# Altium project bt4.PrjPcb
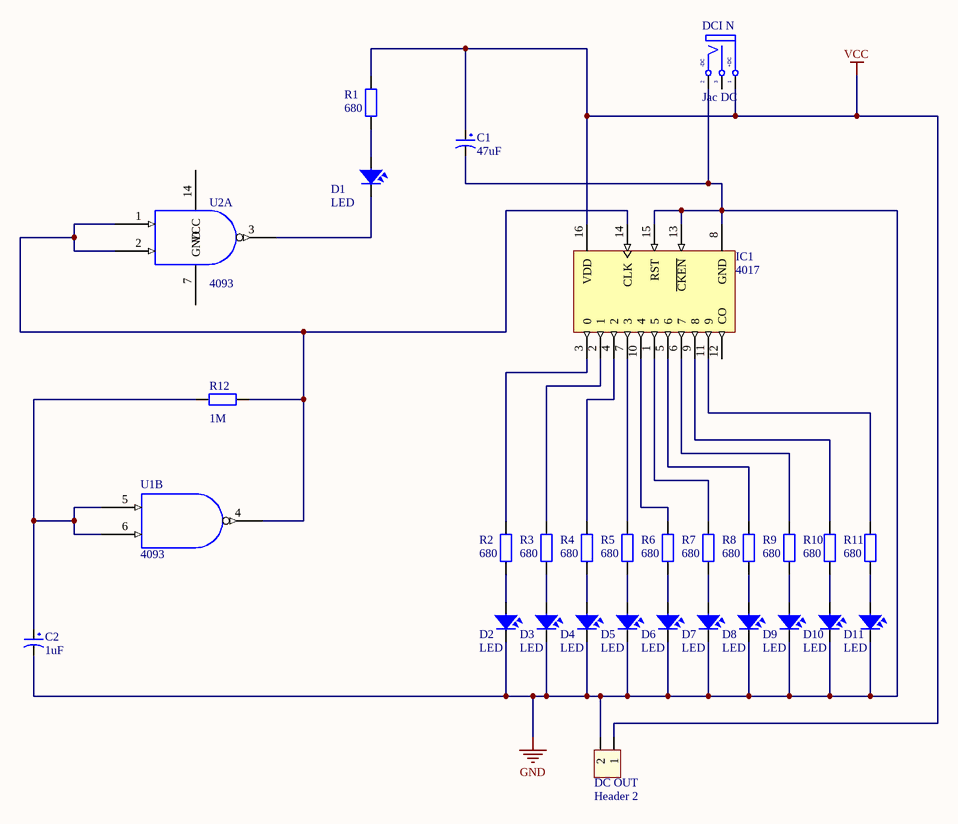
[diagram p0: schematic.SchDoc]
1 sheet, 30 parts. Net scope: global (net labels, ports and power ports of the same name join across sheets).
Board file: PCB.PcbDoc

## Sheet schematic.SchDoc
size A; SheetNumber: 1; SheetTotal: 1

### Parts
C1  47uF  [CP1/2.5]
C2  1uF  [CP1/2.5]
D1  LED  [LED-3]
D2  LED  [LED-3]
D3  LED  [LED-3]
D4  LED  [LED-3]
D5  LED  [LED-3]
D6  LED  [LED-3]
D7  LED  [LED-3]
D8  LED  [LED-3]
D9  LED  [LED-3]
D10  LED  [LED-3]
D11  LED  [LED-3]
DC_OUT  Header 2  [HED2]
DCI_N  Jac DC  [DC-IN]
IC1  4017  [DIP16/W0.3]
R1  680  [DIEN TRO 1/4 W]
R2  680  [DIEN TRO 1/4 W]
R3  680  [DIEN TRO 1/4 W]
R4  680  [DIEN TRO 1/4 W]
R5  680  [DIEN TRO 1/4 W]
R6  680  [DIEN TRO 1/4 W]
R7  680  [DIEN TRO 1/4 W]
R8  680  [DIEN TRO 1/4 W]
R9  680  [DIEN TRO 1/4 W]
R10  680  [DIEN TRO 1/4 W]
R11  680  [DIEN TRO 1/4 W]
R12  1M  [DIEN TRO 1/4 W]
U1  4093  [DIP14]  (part B of 4)
U2  4093  [DIP14]  (part A of 4)

### Nets
GND: C1.2 C2.2 D2.2 D3.2 D4.2 D5.2 D6.2 D7.2 D8.2 D9.2 D10.2 D11.2 DC_OUT.2 DCI_N.2(TN) IC1.8(GND) IC1.13(~{CKEN}) IC1.15(RST)
VCC: C1.1 DC_OUT.1 DCI_N.1(T) IC1.16(VDD) R1.2
NetC2_1: C2.1 R12.2 U1.5 U1.6
NetD1_1: D1.1 R1.1
NetD1_2: D1.2 U2.3
NetD2_1: D2.1 R2.1
NetD3_1: D3.1 R3.1
NetD4_1: D4.1 R4.1
NetD5_1: D5.1 R5.1
NetD6_1: D6.1 R6.1
NetD7_1: D7.1 R7.1
NetD8_1: D8.1 R8.1
NetD9_1: D9.1 R9.1
NetD10_1: D10.1 R10.1
NetD11_1: D11.1 R11.1
NetIC1_1: IC1.1(5) R7.2
NetIC1_2: IC1.2(1) R3.2
NetIC1_3: IC1.3(0) R2.2
NetIC1_4: IC1.4(2) R4.2
NetIC1_5: IC1.5(6) R8.2
NetIC1_6: IC1.6(7) R9.2
NetIC1_7: IC1.7(3) R5.2
NetIC1_9: IC1.9(8) R10.2
NetIC1_10: IC1.10(4) R6.2
NetIC1_11: IC1.11(9) R11.2
NetIC1_14: IC1.14(CLK) R12.1 U1.4 U2.1 U2.2

Not connected (* = marked no-connect by the designer): DCI_N 3(S); IC1 12(CO); U2 7(GND) 14(VCC)

### Notes on the sheet
- (in symbol DCIN) -DC; +DC

### Library data of the parts
C1 C2 = CP2: C 47uF/50V , 220uF/16V; Value: 47uF/16 - 50V; Description 1: 470uF/6,3V - 330uF/10V - 220uF/16V; Description 2: 100uF/25V - 35V - 47uF/50V - 22uF/100V; Description 3: 33uF => 47uF/63V - 1uF => 4,7uF/160V; Description 4: 1uF => 2,2uF/250V - 1uF/350V
D1-D11 = LED: LED Single colour Green and Red; Value: LED 3 ly Single Colour
DC_OUT = Hed2: Header 2 (Green); Value: Header 2
DCI_N = DCIN: Jac DC input; Value: Jac DC
IC1 = 4017: Decade Counter/Divider with 10 Decoded Outputs; Designed by: VanDungEvn; Value: CD4017
R1-R12 = Res 1/4 W: Resistor; Value: R; Published: 8-Jun-2000; LatestRevisionDate: 17-Jul-2002; LatestRevisionNote: Re-released for DXP Platform.; PackageReference: AXIAL-0.4; Publisher: Altium Limited
U1 U2 = 4093: Quad 2-INPUT NAND SCHMITT TRIGGER